# EAGLE board u4xVCA_v3 (EAGLE 9.2.1)
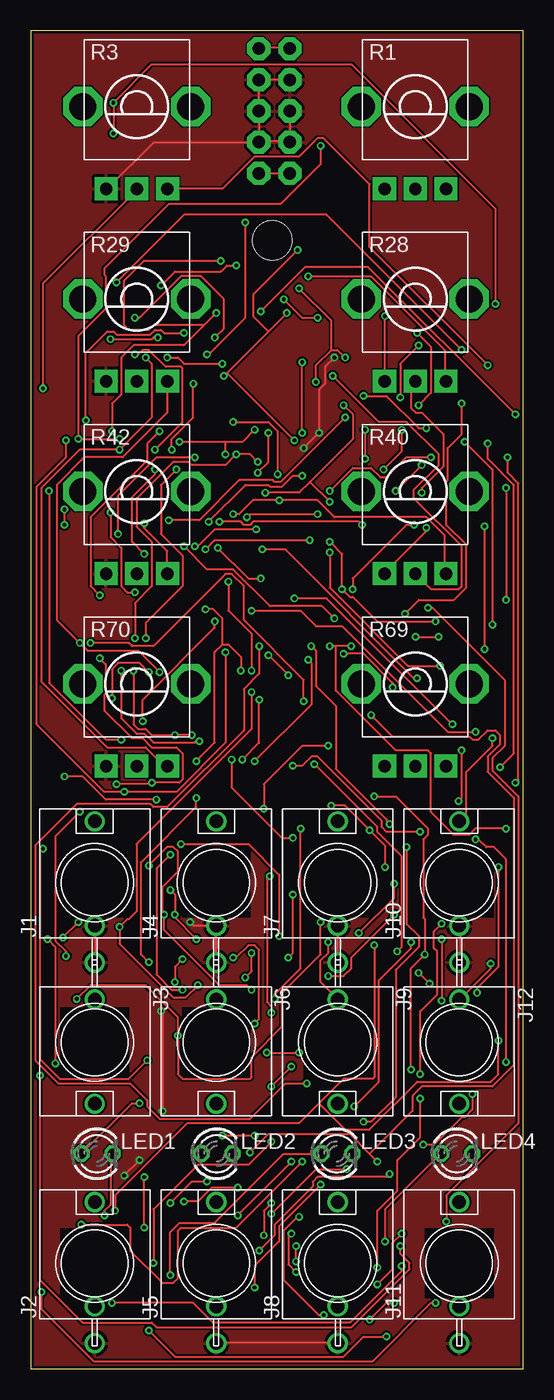
[diagram p5: board, top side]
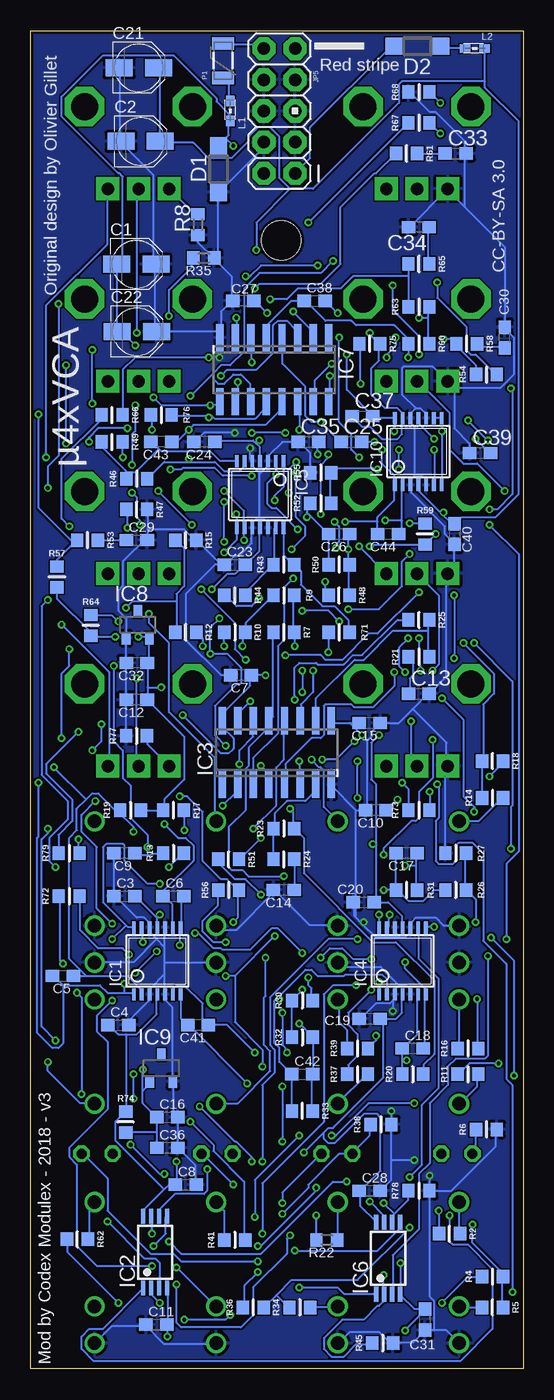
[diagram p6: board, bottom side, seen from below]

Size 40.14 x 109 mm. Coordinates in mm from the lower left corner, seen from the top.
Outline: 0,0 40.14,0 40.14,109 0,109 0,0
Copper layers (1*16): Top 0.035mm / dielectric 1.5mm / Bottom 0.035mm
Design rules "dirt_cheap_dirty_boards.v1.1": minimum track width 6mil, minimum drill 12mil, track to track 6mil, track to pad 6mil, pad to pad 6mil, via to via 6mil, smd to smd 0mil, copper to edge 10mil, drill to drill 10mil, minimum pad ring 10mil, minimum via ring 6mil, stop-mask expansion 2mil, vias tented up to drill 25mil, thermal gap 10mil
Holes 3.2 mm at 19.7,91.9

## Footprints (pad centres in the part's own frame; a part is rotated, then mirrored left to right if it is on the bottom)
PANASONIC_B = smd 2.2 x 1.4: + 1.6,0; - -1.6,0
C0603 = smd 1.1 x 1: 1 -0.85,0; 2 0.85,0
SOD123 = smd 1.4 x 1.4: A 1.9,0; C -1.9,0
TSSOP14 = smd 0.305 x 0.991: 1 -1.905,-2.718; 2 -1.27,-2.718; 3 -0.635,-2.718; 4 0,-2.718; 5 0.635,-2.718; 6 1.27,-2.718; 7 1.905,-2.718; 8 1.905,2.718; 9 1.27,2.718; 10 0.635,2.718; 11 0,2.718; 12 -0.635,2.718; 13 -1.27,2.718; 14 -1.905,2.718
TSSOP8 = smd 0.35 x 1.2: 1 -0.975,-2.925; 2 -0.325,-2.925; 3 0.325,-2.925; 4 0.975,-2.925; 5 0.975,2.925; 6 0.325,2.925; 7 -0.325,2.925; 8 -0.975,2.925
SOIC16N = smd 0.6 x 2.2: 1 -4.445,-2.6; 2 -3.175,-2.6; 3 -1.905,-2.6; 4 -0.635,-2.6; 5 0.635,-2.6; 6 1.905,-2.6; 7 3.175,-2.6; 8 4.445,-2.6; 9 4.445,2.6; 10 3.175,2.6; 11 1.905,2.6; 12 0.635,2.6; 13 -0.635,2.6; 14 -1.905,2.6; 15 -3.175,2.6; 16 -4.445,2.6
DBZ_R-PDSO-G3 = smd 0.7 x 1: 1 -0.95,-1.1; 2 0.95,-1.1; 3 0,1.1
WQP-PJ301M-12_JACK = drill 1.1: P$1 0,5; P$2 0,-3.5; P$3 0,-6.5
AVR_ICSP = drill 1.016 pad 1.88 octagon: 1 -1.27,5.08; 2 1.27,5.08; 3 -1.27,2.54; 4 1.27,2.54; 5 -1.27,0; 6 1.27,0; 7 -1.27,-2.54; 8 1.27,-2.54; 9 -1.27,-5.08; 10 1.27,-5.08
0603 = smd 0.85 x 0.7: 1 -0.9,0; 2 0.7,0
LED3MM = drill 0.813 octagon: A -1.27,0; K 1.27,0
PTC-1206 = smd 1 x 1.8: 1 -1.4,0; 2 1.4,0
ALPS_POT_VERTICAL = drill 1 pad 1.88 square: P$1 -2.5,6.7; P$2 0,6.7; P$3 2.5,6.7 | drill 2.2 pad 3.175 octagon: P$4 -4.4,0; P$5 4.4,0
PARTS_AMAN_RESISTOR_0603 = smd 1 x 1.1: 1 -0.85,0; 2 0.85,0
R0603 = smd 1 x 1.1: 1 -0.85,0; 2 0.85,0

## Placement (x,y rotation side)
C1  22u  [PANASONIC_B]  31.53,89.99 0 bottom
C2  22u  [PANASONIC_B]  31.18,99.99 0 bottom
C3  100n  [C0603]  32.5,38.5 0 bottom
C4  100n  [C0603]  33,28 0 bottom
C5  47p  [C0603]  37.5,32 180 bottom
C6  100p  [C0603]  28.5,38.5 0 bottom
C7  100n  [C0603]  23,56.5 180 bottom
C8  100n  [C0603]  27.5,15 0 bottom
C9  560p  [C0603]  32.5,42 180 bottom
C10  560p  [C0603]  12,45.5 180 bottom
C11  100n  [C0603]  29.9,3.6 0 bottom
C12  470n  [C0603]  31.5,54.5 180 bottom
C13  560p  [C0603]  8.5,55 0 bottom
C14  560p  [C0603]  19.5,39 180 bottom
C15  100n  [C0603]  12.5,52.6 180 bottom
C16  470n  [C0603]  29,20.5 0 bottom
C17  100p  [C0603]  9.5,42 180 bottom
C18  47p  [C0603]  9,26.1 0 bottom
C19  100n  [C0603]  12.5,28.5 180 bottom
C20  100n  [C0603]  13,38 0 bottom
C21  22u  [PANASONIC_B]  31.33,105.99 0 bottom
C22  22u  [PANASONIC_B]  31.48,84.49 0 bottom
C23  100n  [C0603]  23.5,65.5 0 bottom
C24  100n  [C0603]  26,75.5 180 bottom
C25  47p  [C0603]  14,75.5 0 bottom
C26  100p  [C0603]  15,68 180 bottom
C27  100n  [C0603]  22.8,87 180 bottom
C28  100n  [C0603]  12.5,14.5 0 bottom
C29  560p  [C0603]  31.5,67.5 0 bottom
C30  560p  [C0603]  1.5,84 90 bottom
C31  100n  [C0603]  8,4 90 bottom
C32  470n  [C0603]  31.5,57.5 180 bottom
C33  560p  [C0603]  5.5,99 0 bottom
C34  560p  [C0603]  8.5,93 180 bottom
C35  100n  [C0603]  17.5,75.5 0 bottom
C36  470n  [C0603]  29,18 0 bottom
C37  100p  [C0603]  13.1,77.6 0 bottom
C38  47p  [C0603]  17,87 0 bottom
C39  100n  [C0603]  3.5,74.6 0 bottom
C40  100n  [C0603]  5.6,68 270 bottom
C41  47p  [C0603]  26.5,28 180 bottom
C42  47p  [C0603]  18,24 0 bottom
C43  47p  [C0603]  29.5,75.5 180 bottom
C44  47p  [C0603]  11,68 180 bottom
D1  1N5819HW  [SOD123]  24.82,97.73 90 bottom
D2  1N5819HW  [SOD123]  8.62,107.73 180 bottom
IC1  OPA1654  [TSSOP14]  29.82,33.22 0 bottom
IC2  LM358PW  [TSSOP8]  30,9.5 0 bottom
IC3  V2164SZ  [SOIC16N]  20.09,50.19 0 bottom
IC4  OPA1654  [TSSOP14]  9.83,33.22 0 bottom
IC5  OPA1654  [TSSOP14]  21.44,71.22 180 bottom
IC6  LM358PW  [TSSOP8]  11,9 0 bottom
IC7  V2164SZ  [SOIC16N]  20.29,81.39 180 bottom
IC8  LM4040C25  [DBZ_R-PDSO-G3]  31.41,60.61 0 bottom
IC9  LM4040C10  [DBZ_R-PDSO-G3]  29.5,24.5 0 bottom
IC10  OPA1654  [TSSOP14]  8.55,74.72 0 bottom
J1  [WQP-PJ301M-12_JACK]  5.22,39.59 0 top
J2  [WQP-PJ301M-12_JACK]  5.22,8.59 0 top
J3  [WQP-PJ301M-12_JACK]  5.22,26.59 180 top
J4  [WQP-PJ301M-12_JACK]  15.12,39.59 0 top
J5  [WQP-PJ301M-12_JACK]  15.12,8.59 0 top
J6  [WQP-PJ301M-12_JACK]  15.12,26.59 180 top
J7  [WQP-PJ301M-12_JACK]  25.03,39.59 0 top
J8  [WQP-PJ301M-12_JACK]  25.03,8.59 0 top
J9  [WQP-PJ301M-12_JACK]  25.03,26.59 180 top
J10  [WQP-PJ301M-12_JACK]  34.93,39.59 0 top
J11  [WQP-PJ301M-12_JACK]  34.93,8.59 0 top
J12  [WQP-PJ301M-12_JACK]  34.93,26.59 180 top
JP5  M05X2PTH  [AVR_ICSP]  19.86,102.46 180 bottom
L1  742792664  [0603]  23.88,102.56 90 bottom
L2  742792664  [0603]  4.03,107.56 180 bottom
LED1  604-WP937EGW - R/G  [LED3MM]  5.4,17.53 0 top
LED2  R/G  [LED3MM]  15.18,17.53 0 top
LED3  R/G  [LED3MM]  24.95,17.53 0 top
LED4  R/G  [LED3MM]  34.73,17.53 0 top
P1  PTCSMD  [PTC-1206]  24.46,106.56 90 bottom
R1  10kB  [ALPS_POT_VERTICAL]  31.35,102.82 180 top
R2  510  [PARTS_AMAN_RESISTOR_0603]  6,11 180 bottom
R3  10kB  [ALPS_POT_VERTICAL]  8.65,102.82 180 top
R4  5.6k  [PARTS_AMAN_RESISTOR_0603]  2.5,7.5 0 bottom
R5  5.1k  [PARTS_AMAN_RESISTOR_0603]  2.5,5 180 bottom
R6  1.2k  [PARTS_AMAN_RESISTOR_0603]  3,19.5 0 bottom
R7  100k  [PARTS_AMAN_RESISTOR_0603]  19.5,60 180 bottom
R8  510  [R0603]  26.5,93.2 90 bottom
R9  5.1k  [PARTS_AMAN_RESISTOR_0603]  19.5,63 0 bottom
R10  5.1k  [PARTS_AMAN_RESISTOR_0603]  23.5,60 0 bottom
R11  100k  [PARTS_AMAN_RESISTOR_0603]  4.5,24 0 bottom
R12  1.0M  [PARTS_AMAN_RESISTOR_0603]  27.5,60 180 bottom
R13  510  [PARTS_AMAN_RESISTOR_0603]  28.5,42 0 bottom
R14  100k  [PARTS_AMAN_RESISTOR_0603]  2.5,46.5 0 bottom
R15  1.0M  [PARTS_AMAN_RESISTOR_0603]  27.5,67.5 180 bottom
R16  24k  [PARTS_AMAN_RESISTOR_0603]  4.5,26.1 0 bottom
R17  49.9k  [PARTS_AMAN_RESISTOR_0603]  28.5,45.5 180 bottom
R18  510  [PARTS_AMAN_RESISTOR_0603]  2.5,49.5 180 bottom
R19  20M  [PARTS_AMAN_RESISTOR_0603]  32,45.5 0 bottom
R20  20M  [PARTS_AMAN_RESISTOR_0603]  9,24 0 bottom
R21  510  [PARTS_AMAN_RESISTOR_0603]  8.5,58 0 bottom
R22  510  [R0603]  16,10.5 180 bottom
R23  49.9k  [PARTS_AMAN_RESISTOR_0603]  19.5,44 0 bottom
R24  510  [PARTS_AMAN_RESISTOR_0603]  19.5,41.5 180 bottom
R25  100k  [PARTS_AMAN_RESISTOR_0603]  8.5,61 180 bottom
R26  1.0M  [PARTS_AMAN_RESISTOR_0603]  5.5,39 0 bottom
R27  1.0M  [PARTS_AMAN_RESISTOR_0603]  5.5,42 0 bottom
R28  10kB  [ALPS_POT_VERTICAL]  31.35,87.14 180 top
R29  10kB  [ALPS_POT_VERTICAL]  8.65,87.14 180 top
R30  5.1k  [PARTS_AMAN_RESISTOR_0603]  18,30 0 bottom
R31  5.1k  [PARTS_AMAN_RESISTOR_0603]  9.5,39 0 bottom
R32  5.1k  [PARTS_AMAN_RESISTOR_0603]  18,27 0 bottom
R33  100k  [PARTS_AMAN_RESISTOR_0603]  18,21 180 bottom
R34  5.1k  [PARTS_AMAN_RESISTOR_0603]  18.2,5 0 bottom
R35  510  [R0603]  26.03,90.48 180 bottom
R36  5.6k  [PARTS_AMAN_RESISTOR_0603]  22,5 0 bottom
R37  100k  [PARTS_AMAN_RESISTOR_0603]  13.5,24 0 bottom
R38  1.2k  [PARTS_AMAN_RESISTOR_0603]  11.59,19.9 0 bottom
R39  24k  [PARTS_AMAN_RESISTOR_0603]  13.5,26.1 0 bottom
R40  10kB  [ALPS_POT_VERTICAL]  31.35,71.47 180 top
R41  510  [PARTS_AMAN_RESISTOR_0603]  23.5,10.5 0 bottom
R42  10kB  [ALPS_POT_VERTICAL]  8.65,71.47 180 top
R43  5.6k  [PARTS_AMAN_RESISTOR_0603]  19.5,65.5 180 bottom
R44  5.1k  [PARTS_AMAN_RESISTOR_0603]  23.5,63 180 bottom
R45  1.2k  [PARTS_AMAN_RESISTOR_0603]  11.45,2.1 0 bottom
R46  100k  [PARTS_AMAN_RESISTOR_0603]  31.5,72.5 0 bottom
R47  510  [PARTS_AMAN_RESISTOR_0603]  31.5,70 180 bottom
R48  5.1k  [PARTS_AMAN_RESISTOR_0603]  15,63 180 bottom
R49  5.1k  [PARTS_AMAN_RESISTOR_0603]  33.5,75.5 180 bottom
R50  5.1k  [PARTS_AMAN_RESISTOR_0603]  15,65.5 0 bottom
R51  100k  [PARTS_AMAN_RESISTOR_0603]  24,41.5 180 bottom
R52  1.0M  [PARTS_AMAN_RESISTOR_0603]  16.5,70.5 0 bottom
R53  510  [PARTS_AMAN_RESISTOR_0603]  35.5,67.5 180 bottom
R54  100k  [PARTS_AMAN_RESISTOR_0603]  3,81 0 bottom
R55  1.0M  [PARTS_AMAN_RESISTOR_0603]  16.5,73 0 bottom
R56  24k  [PARTS_AMAN_RESISTOR_0603]  24,39 0 bottom
R57  49.9k  [PARTS_AMAN_RESISTOR_0603]  38,64.5 270 bottom
R58  510  [PARTS_AMAN_RESISTOR_0603]  4.6,83.5 180 bottom
R59  20M  [PARTS_AMAN_RESISTOR_0603]  8,68 270 bottom
R60  20M  [PARTS_AMAN_RESISTOR_0603]  8.5,83.5 0 bottom
R61  510  [PARTS_AMAN_RESISTOR_0603]  9.5,99 180 bottom
R62  510  [PARTS_AMAN_RESISTOR_0603]  36.33,10.56 180 bottom
R63  49.9k  [PARTS_AMAN_RESISTOR_0603]  8.5,86.5 0 bottom
R64  24k  [PARTS_AMAN_RESISTOR_0603]  35.25,60.56 270 bottom
R65  510  [PARTS_AMAN_RESISTOR_0603]  8.5,90 180 bottom
R66  100k  [PARTS_AMAN_RESISTOR_0603]  33.5,77.7 180 bottom
R67  1.0M  [PARTS_AMAN_RESISTOR_0603]  8.5,101.5 0 bottom
R68  1.0M  [PARTS_AMAN_RESISTOR_0603]  8.5,104 0 bottom
R69  10kB  [ALPS_POT_VERTICAL]  31.35,55.79 180 top
R70  10kB  [ALPS_POT_VERTICAL]  8.65,55.79 180 top
R71  5.1k  [PARTS_AMAN_RESISTOR_0603]  15,60 0 bottom
R72  24k  [PARTS_AMAN_RESISTOR_0603]  37,38.5 0 bottom
R73  5.1k  [PARTS_AMAN_RESISTOR_0603]  8.5,45.5 0 bottom
R74  3.6k  [PARTS_AMAN_RESISTOR_0603]  32.4,20.1 270 bottom
R75  5.1k  [PARTS_AMAN_RESISTOR_0603]  12.5,83.5 180 bottom
R76  100k  [PARTS_AMAN_RESISTOR_0603]  29.5,77.7 0 bottom
R77  510  [PARTS_AMAN_RESISTOR_0603]  31.51,51.56 0 bottom
R78  1.2k  [PARTS_AMAN_RESISTOR_0603]  8.5,14.5 0 bottom
R79  100k  [PARTS_AMAN_RESISTOR_0603]  37,42 0 bottom

## Tracks (layer width: path | path; a pad name or v marks a point on that pad's centre or on a via)
1_TO_2  (via drill 0.3)
  Top 0.152: v29.62,39.5 29.62,38.38 v26.75,35.5 | v18,33.88 18,32.38 v17.5,31.88 | v6.62,5.38 13.25,5.38 14.88,3.75 26,3.75 30.25,8 v30.25,8.38 | v33.5,35 v33.5,30
  Bottom 0.152: 32.38,36.12 34.25,38 34.25,42.5 34,42.75 32.62,42.75 32.5,42.62 32.5,41.38 30.62,39.5 v29.62,39.5 | 32.38,36.12 32.25,36 31.75,36 IC1.14 | v26.75,35.5 26.5,35.5 25.25,34.25 24.62,34.25 24.5,34.12 22.25,34.12 20.5,35.88 20,35.88 v18,33.88 | v17.5,31.88 17.5,31.25 17.25,31 17.25,30 R30.2 | R4.1 4.5,7.5 v6.62,5.38 | v30.25,8.38 34.75,8.38 36.38,10 36.38,16.62 37,17.25 37,18 33.88,21.12 33.88,26.62 34.75,27.5 34.75,28.75 v33.5,30 | 32.38,36.12 v33.5,35
2_TO_3  (via drill 0.3)
  Top 0.152: v18,55.12 18,52.12 8.62,42.75 8.62,37.25 8,36.62 7.88,36.62 v7.25,36 7.25,34.62 11.62,30.25 12.62,30.25 v13.62,31.25 | v18,56.88 18,59.88 16.12,61.75 v16.12,64.12 | v21.62,7.88 21,8.5 21,10.75 v21.25,11
  Bottom 0.152: v7.25,36 7.88,36 IC4.8 | v18,56.88 v18,55.12 | v16.12,64.12 16.12,63.25 15.88,63 R48.2 | v21.62,7.88 22.75,6.75 22.75,5 R36.1 | v21.25,11 21.25,15.12 16.25,20.12 16.25,30.5 15.5,31.25 v13.62,31.25
3_TO_4
  Bottom 0.152: IC5.14 19.5,68.5 19.5,66.25 18.75,65.5 R43.1 18.62,65.5 18.12,65 18.12,63.88 16.38,62.12 15.38,62.12 14.25,61 14.25,60 R71.2
AREF_+10  (via drill 0.3)
  Top 0.152: v31,24.38 31,32.62 v32.12,33.75 32.12,36.62 32,36.75 32,43.12 32.38,43.5 32.38,44 29.75,46.62 v28,46.62 | v3.75,30.12 4.88,31.25 9.38,31.25 12,28.62 v12,27.12 12,24 12.38,23.62 17.88,23.62 18,23.75 18,25.38 20.5,27.88 20.5,30.62 23.62,33.75 v23.62,36.38
  Bottom 0.152: 31,22.62 30.5,23.12 30.5,23.38 IC9.1 | 31,22.62 31,21.62 29.88,20.5 | 29.88,20.5 29.88,19.25 | 29.88,19.25 29.88,18 C36.1 | 29.88,20.5 C16.1 | 29.88,19.25 R74.2 | v32.12,33.75 32.62,34.25 34.62,34.25 36.12,35.75 36.12,38.5 R72.2 | 31,22.62 v31,24.38 | v3.75,30.12 3.75,26.12 R16.2 | v12,27.12 12,26.75 R39.2 | 23.25,39 23.25,36.75 v23.62,36.38 | v28,46.62 27.38,46.62 26.12,45.38 26.12,41.38 24.62,39.88 24.12,39.88 23.25,39 | 23.25,39 R56.2
AREF_-2.5  (via drill 0.3)
  Top 0.152: v12.5,67 14.38,65.12 16.5,65.12 19.5,62.12 23.75,62.12 v24.75,61.12 | v25.5,58.25 27.12,58.25 29.5,55.88 v29.5,55.5 | v8.5,85.62 8.88,85.62 12.25,89 13.88,89 15.75,87.12 15.75,84.75 v15,84 | v13.38,74.25 10.25,74.25 7.12,71.12 v7.12,68 | v31.38,59.62 v33.25,59.62 | v19,45.62 19,47.62 22.12,50.75 v24.25,50.75
  Bottom 0.152: R20.2 8.12,24 8.12,24.75 7.25,25.62 7.25,31.62 10.38,34.75 12.25,34.75 17.88,40.38 17.88,43.25 18.62,44 R23.2 18.75,44 18.75,45.38 v19,45.62 | R57.2 38,62.75 35.25,60 R64.2 35.25,59.62 v33.25,59.62 | 7.75,85.62 7.75,86.5 R63.2 | 7.75,85.62 7.75,83.5 R60.2 | R19.2 R17.2 29.25,45.5 29.25,46.38 27.62,48 27.62,51.5 30.62,54.5 | 30.62,57.5 30.5,57.62 30.5,59.5 IC8.2 30.5,59.62 v31.38,59.62 | 30.62,57.5 30.62,55.5 | 30.62,55.5 30.62,54.5 | 30.62,57.5 C32.1 | 8,67.12 12.38,67.12 v12.5,67 | v24.75,61.12 25.5,60.38 v25.5,58.25 24.12,58.25 23,57.12 23,55.88 23.12,55.75 23.38,55.75 25.12,54 25.12,51.62 v24.25,50.75 | 30.62,55.5 v29.5,55.5 | 30.62,54.5 C12.1 | v8.5,85.62 7.75,85.62 | v15,84 15,77.12 14,76.12 14,74.88 v13.38,74.25 | 8,67.12 v7.12,68 | 8,67.12 R59.2
CV_IN_1
  Bottom 0.152: R11.2 3.75,24 3.75,23 5.12,21.62 J3.P$1
FOO  (via drill 0.3)
  Top 0.152: v28.88,40.88 28.88,42.62 v27.62,43.88 25.62,45.88 v24.5,45.88
  Bottom 0.152: v28.88,40.88 27.75,42 R13.2 | v27.62,43.88 27.62,45.5 R17.1 | v24.5,45.88 23.38,47 23.38,47.5 IC3.2
FOO1
  Bottom 0.152: R24.2 20.38,41.5 20.38,44 R23.1 20.25,44 20.25,45.25 19.25,46.25 17.75,46.25 17,47 17,47.5 IC3.7
FOO2  (via drill 0.3)
  Top 0.152: v18.75,86.12 22.38,89.75 27.5,89.75 v39.5,77.75
  Bottom 0.152: R57.1 38,65.88 36.62,67.25 | 36.62,67.25 36.38,67.5 R53.2 36.62,67.25 | v18.75,86.12 17.12,84.5 17.12,84 IC7.2 | v39.5,77.75 39.5,70.12 36.62,67.25
FOO3  (via drill 0.3)
  Top 0.152: v23.38,85.62 22.12,85.62 v20.62,87.12
  Bottom 0.152: 9.38,89 9.38,90 R65.2 | 9.38,89 9.38,86.5 R63.1 | v23.38,85.62 23.38,84 IC7.7 | v20.62,87.12 19.25,87.12 18.38,88 14.88,88 13.88,89 9.38,89
GND  (via drill 0.3)
  Top 0.152: v7.62,15.75 v8.88,17 | J5.P$3 15.12,2.12 25,2.12 J8.P$3 | J4.P$3 15.12,33.12 15.12,36 J4.P$2 15,36.12 13.25,36.12 v13,36.38 | J10.P$3 35,33.12 35,36 J10.P$2 | J7.P$3 25,33.12 25,36 J7.P$2 | v10.75,21 10.75,29 v10.62,29.12 | J1.P$3 5.25,33.12 5.25,36 J1.P$2 | v22.25,75 v23.5,76.25 23.5,79.75 24,80.25 24,81.62 v24.75,82.38 | JP5.8 18.62,105 | 18.62,100 18.62,102.38 JP5.5 18.62,102.5 18.62,105 | 21.12,100 21.12,102.38 JP5.6 | 21.12,100 18.62,100 | 18.62,100 JP5.3 18.5,99.88 10,99.88 6.25,96.12 R3.P$3 | 21.12,100 JP5.4 | 18.62,105 JP5.7
  Bottom 0.152: 10.75,17 10.75,15.38 11.62,14.5 C28.2 | 10.75,17 10.75,19.88 R38.2 10.75,20 v10.75,21 | 7.62,14.5 5.88,14.5 2.25,18.12 2.25,19.5 R6.2 | v8.88,17 10.75,17 | 7.62,14.5 v7.62,15.75 | 7.25,3.12 6.25,3.12 5.25,2.12 J2.P$3 | 7.25,3.12 8,3.12 | 8,3.12 9,2.12 10.5,2.12 R45.2 10.62,2.12 10.88,2.12 11.75,3 14.12,3 15,2.12 J5.P$3 | 8,3.12 C31.1 | 30.75,3.5 33.5,3.5 34.88,2.12 J11.P$3 | 30.75,3.5 29.25,2 25.12,2 J8.P$3 | 30.75,3.5 C11.1 | 7.62,14.5 7.62,5.88 7.25,5.5 7.25,3.12 | 7.62,14.5 R78.2 | J4.P$2 15.12,36.12 17.38,36.12 20.25,39 C14.2 20.38,39 20.38,38.75 23.38,35.75 24.75,35.75 25,36 J7.P$2 | 10.12,31.25 9.5,31.25 9.25,31 9.25,30.62 IC4.5 | 10.12,31.25 10.38,31 10.38,30.62 IC4.3 10.5,30.5 10.5,30.12 10.62,30 | 10.62,30 10.88,29.75 12,29.75 13.25,28.5 C19.2 | 10.12,31.25 11.62,32.75 14.75,32.75 15,33 J4.P$3 | 28.12,18 26.75,16.62 26.75,15 C8.2 | 28.12,18 28.12,20.5 C16.2 28.25,20.5 28.5,20.75 28.5,23.38 IC9.2 28.62,23.5 28.62,29.5 29.12,30 29.12,30.5 IC1.5 29.25,30.62 29.25,32.12 | 28.12,18 C36.2 | C9.2 33.38,42 33.38,38.5 C3.1 33.25,38.5 31.5,36.75 30.88,36.75 30.5,36.38 30.5,36 IC1.12 30.38,35.88 30.38,35.5 29.88,35 | 29.25,34.38 29.25,35.88 IC1.10 | 29.25,34.38 29.25,33.12 | 29.25,33.12 29.25,32.12 | 29.25,32.12 30.38,31 30.38,30.62 IC1.3 30.5,30.5 30.5,30 32.12,28.38 32.12,28 C4.2 | 29.25,34.38 29.88,35 | 29.25,33.12 25.12,33.12 J7.P$3 | 29.88,35 31.75,33.12 34.88,33.12 J10.P$3 | 10.62,30 v10.62,29.12 | 13.62,45.5 C10.2 12.75,45.5 12.75,51.12 12.38,51.5 12.38,51.88 C15.1 11.62,52.62 10.12,52.62 9,53.75 | 13.62,45.5 15.62,47.5 IC3.8 | 10,35.12 9.62,35.12 9.25,35.5 9.25,35.88 IC4.10 9.12,36 9.12,36.38 8.75,36.75 7.12,36.75 6.5,36.12 5.25,36.12 J1.P$2
  Bottom 0.152: 10,35.12 10.38,35.5 10.38,35.88 IC4.12 | 13.12,36.25 12,35.12 10,35.12 | 13.12,36.25 13.62,36.75 | 13.62,36.75 13.75,36.88 13.75,38 C20.1 | 13.62,36.75 13.62,45.5 | 8.88,72.75 8.25,72.75 8,72.5 8,72.12 IC10.5 | 8.88,72.75 9.12,72.5 9.12,72.12 IC10.3 9.12,72 9.12,71.38 6.38,68.62 6.38,68 5.62,67.25 C40.2 5.62,67.12 5.62,65.38 6.12,64.88 R42.P$3 6.25,64.75 6.25,56.38 7.62,55 C13.2 7.75,55 9,53.75 | 8.75,78.25 8.38,78.25 8,77.88 8,77.5 IC10.10 | 8.75,78.25 9.12,77.88 9.12,77.5 IC10.12 9.12,77.38 9.12,77 8.88,76.75 8.88,72.75 | R27.1 6.38,42 6.38,48.88 6.25,49 R70.P$3 6.25,49.12 6.25,51 9,53.75 | R55.1 17.38,73 17.38,74.62 18.25,75.5 C35.1 19.62,75.5 20.75,74.38 20.75,74 IC5.3 20.88,73.88 20.88,73.5 21.5,72.88 | 21.5,69.25 21.75,69.25 22,69 22,68.62 IC5.10 22.12,68.5 22.12,67.25 23.12,66.25 23.5,66.25 24.25,65.5 C23.1 | 21.5,69.25 21.12,69.25 20.88,69 20.88,68.62 IC5.12 | 21.5,69.25 21.5,72.88 | 21.5,72.88 21.5,73 22,73.5 22,73.88 IC5.5 22.12,74 22.25,74.12 v22.25,75 | v23.5,76.25 26,76.25 26.75,75.5 C24.2 | 32.38,57.5 32.38,59.5 IC8.1 32.38,59.62 32.38,61.12 33,61.75 33,63.38 32.62,63.75 32.62,65.75 30.62,67.75 | 32.38,54.5 32.38,51.62 R77.1 | 32.38,54.5 32.38,57.5 | 32.38,57.5 C32.2 | 32.38,54.5 C12.2 | 30.62,68.38 30.62,70 R47.1 | 30.62,68.38 30.62,67.75 | 30.62,67.75 30.62,67.5 C29.2 30.62,67.75 | C7.2 24.62,56.5 27.5,59.38 27.5,63.12 25.12,65.5 24.62,65.5 | C23.1 24.62,65.5 | 24.62,65.5 26.62,67.5 R15.1 26.75,67.5 27.62,68.38 30.62,68.38 | 24.38,65.5 C23.1 | 5.62,79.88 5.62,76.62 4.38,75.38 4.38,74.62 C39.1 | 5.62,79.88 6.12,80.38 R29.P$3 | 4.75,94.62 6.12,96 R3.P$3 6.25,96 9.25,93 C34.2
  Bottom 0.152: 4.75,94.62 1.5,91.38 C30.2 1.5,84.75 0.75,84 0.75,81 1.88,79.88 5.62,79.88 | 4.75,94.62 4.75,99 | 4.75,99 4.75,100 7.12,102.38 7.62,102.38 9.25,104 R68.1 | 4.75,99 C33.2 | 5.62,79.88 R29.P$3 | C21.- 32.88,105.88 32.88,100 C2.- 32.75,99.88 30.12,97.25 30.12,90.12 30,90 C1.+ 30,89.88 30,84.5 C22.+ 24.62,84.5 | 23.75,87 23.75,89 24.88,90.12 | 24.88,90.12 25.12,90.38 R35.1 | R8.1 26.5,91.75 25.25,90.5 R35.1 | 24.88,90.12 24.88,95.75 D1.C 24.75,95.88 21.25,99.38 21.25,99.88 JP5.4 | 24.88,90.12 R35.1 | 24.62,84.5 24.62,86.12 23.75,87 | 24.62,84.5 24.62,84 IC7.8 | 23.75,87 C27.2 | 24.62,84.5 IC7.8 | v24.75,82.38 24.75,83.88 IC7.8 | 8.75,78.25 9.88,79.38 9.88,81.5 9.75,81.62 7.38,81.62 6.25,80.5 R29.P$3 | 13.12,36.25 v13,36.38
  pour Top (isolate 0.012): 40,109 0,109 0,0 40,0
  pour Bottom (isolate 0.012): 40,109 0,109 0,0 40,0
N$1  (via drill 0.3)
  Top 0.152: v33.88,12 33.88,14.12 39.75,20 39.75,46.62 37.62,48.75 37.62,49.75 38.62,50.75 38.62,56.12 32.75,62 v32.38,62
  Bottom 0.152: 28.25,62.5 28.25,63.12 27.62,63.75 27.62,66.88 28.25,67.5 R15.2 | 28.25,62.5 28.25,60 R12.2 | v33.88,12 30.88,9 30,9 29.62,8.62 29.62,6.62 IC2.3 | v32.38,62 31.88,62.5 28.25,62.5
N$2
  Bottom 0.152: IC10.8 6.75,77.5 7.25,77.5 IC10.9
N$3  (via drill 0.3)
  Top 0.152: v18.62,54.5 18.62,51 v17.25,49.62
  Bottom 0.152: R25.2 10.25,61 13.12,58.12 13.88,58.12 14.62,57.38 16.75,57.38 16.88,57.5 18.25,57.5 18.62,57.12 v18.62,54.5 | v17.25,49.62 16.62,49 16.5,49 16.25,48.75 16.25,45.75 15.12,44.62 J4.P$1
N$4  (via drill 0.3)
  Top 0.152: v30.12,10 30.12,9.38 30.88,8.62 30.88,8.12 26.12,3.38 10.25,3.38 9.88,3.75 4.25,3.75 0.75,7.25 v0.75,23.88 | v3.88,36.38 v2.62,35.12
  Bottom 0.152: R27.2 4.75,42 4.75,39 R26.2 4.62,39 3.88,38.25 v3.88,36.38 | v30.12,10 29.12,11 29.12,12.38 IC2.5 | v0.75,23.88 0.75,33.25 v2.62,35.12
N$5  (via drill 0.3)
  Top 0.152: v2.88,33.62 2.88,34 2,34.88 2,43.38 v4,45.38 | v6.62,54.62 6.62,57 7.12,57.5 8.88,57.5 v9.62,56.75 | v9.38,59.5 9.38,60.75 12.38,63.75 12.38,66.25 10.62,68 10.62,72 v11.88,73.25
  Bottom 0.152: R52.2 15.75,70.5 15.75,73 R55.2 15.62,73 15.25,73.38 12.25,73.38 12.12,73.25 v11.88,73.25 | v2.88,33.62 2.88,25.5 3.12,25.25 5.5,25.25 6.12,24.62 6.12,23.12 7.62,21.62 7.62,16.75 8.5,15.88 8.5,11.38 10.62,9.25 10.62,6.12 IC6.3 | v4,45.38 4,45.75 4.88,46.62 4.88,52.88 v6.62,54.62 | v9.62,56.75 10.12,57.25 10.12,58.75 v9.38,59.5
N$6
  Bottom 0.152: R22.1 15.12,10.5 15.12,13.5 J5.P$1
N$7
  Bottom 0.152: R2.1 5.25,11 5.25,13.5 J2.P$1
N$8  (via drill 0.3)
  Top 0.152: v6.75,100.62 v6.75,103.12 9.88,106.25 26.12,106.25 37.88,94.5 v37.88,86.75 | v18.62,9.62 19.88,10.88 19.88,11.75 23,14.88 23,15.25 23.38,15.62 29,15.62 v29.25,15.88 | v32,18.25 32.88,18.25 35.12,20.5 35.38,20.5 36,21.12 v36,22.38 | v36.38,30.62 36.38,31 38.12,32.75 v38.12,40.88 | v38.75,71.75 v38.75,62.62
  Bottom 0.152: v6.75,100.62 7.62,101.5 R67.2 | v6.75,103.12 7.62,104 R68.2 | v18.62,9.62 11.88,9.62 10.12,11.38 10.12,11.88 IC6.5 | v29.25,15.88 29.62,15.88 v32,18.25 | v36,22.38 36,30.25 v36.38,30.62 | v38.12,40.88 38.62,41.38 38.62,43.25 37.12,44.75 37.12,46.25 39.25,48.38 39.25,62.12 v38.75,62.62 | v38.75,71.75 38.75,73.5 37.88,74.38 v37.88,86.75
N$9  (via drill 0.3)
  Top 0.152: v18.75,64.38 17.75,64.38 v15.25,66.88 | v15.38,69 17.12,69 17.38,68.75 17.88,68.75 18.12,69 26.75,69 v27,68.75 | v31.88,73.62 v29.75,71.5 | v31.62,78.5 32.62,79.5 32.62,83.25 v31.5,84.38
  Bottom 0.152: v18.75,64.38 19.5,63.62 19.5,59.38 20,58.88 20,51.75 22,49.75 22,47.62 IC3.3 | v15.25,66.88 15.25,67.12 15,67.38 15,68.62 v15.38,69 | v29.75,71.5 v27,68.75 | v31.88,73.62 31.88,76.12 31.62,76.38 v31.62,78.5 | v31.5,84.38 31.5,95.88 31.38,96 R1.P$2
N$10  (via drill 0.3)
  Top 0.152: v29.25,44.38 29,44.62 29,44.75 24.88,48.88 24.88,54 23.25,55.62 23.25,58.5 v22.88,58.88
  Bottom 0.152: 29.25,38.5 28.62,37.88 28.62,36 IC1.9 | R9.1 20.38,63 22.62,60.75 22.62,60 R10.2 22.75,60 22.88,59.88 v22.88,58.88 | 29.25,38.5 29.25,39 26.88,41.38 26.88,42.62 27.5,43.25 28.12,43.25 v29.25,44.38 | 29.25,38.5 C6.1
N$11
  Top 0.152: JP5.2 18.62,97.38 JP5.1
  Bottom 0.152: D2.A 10.62,107.62 10.88,107.62 17.38,101.12 17.38,98.62 18.5,97.5 JP5.1
N$12
  Top 0.152: JP5.9 18.62,107.62 21.12,107.62 JP5.10
  Bottom 0.152: P1.2 24.38,107.88 21.5,107.88 21.25,107.62 JP5.10
N$13
  Bottom 0.152: L1.2 24,103.38 24,104.75 24.38,105.12 P1.1
N$14  (via drill 0.3)
  Top 0.152: v2,24.88 2,34.38 v1.38,35 | v2.75,70 v2.75,68.75 | v1,79.88 1,88.38 8.62,96 R3.P$2
  Bottom 0.152: v2,24.88 4.38,24.88 5.25,24 R11.1 | v1.38,35 1.38,41.12 0.38,42.12 0.38,66.38 v2.75,68.75 | v2.75,70 2.12,70 0.88,71.25 0.88,79.75 v1,79.88
N$15
  Bottom 0.152: R8.2 26.5,94.12 26.88,94.12 28.75,96 R1.P$3
N$16
  Bottom 0.152: L2.2 4.75,107.62 6.62,107.62 D2.C
N$17
  Bottom 0.152: C13.1 9.25,55 9.25,56.25 9,56.5 9,57.75 9.25,58 R21.1
N$18  (via drill 0.3)
  Top 0.152: v6,12.5 6,12.88 6.5,13.38 6.5,17.38 6.62,17.5 LED1.K
  Bottom 0.152: v6,12.5 6,10.38 5.75,10.12 4.5,10.12 2.5,8.12 2.5,3.25 5.12,0.62 35,0.62 36,1.62 36,2.62 35.38,3.25 34.25,3.25 31,6.5 IC2.1
N$19  (via drill 0.3)
  Top 0.152: v29.62,5.38 29,5.38 v27.62,4 | v23.88,4.38 23.5,4.38 20.62,7.25 20.62,11.25 21.75,12.38 v21.88,12.38 | v15.62,19 v18.25,19 | v8.88,21.62 8.25,21.62 4.25,17.62 LED1.A
  Bottom 0.152: R6.1 3.88,19.5 3.88,17.88 4.12,17.62 LED1.A | v29.62,5.38 30.25,6 30.25,6.5 IC2.2 | v27.62,4 24.25,4 v23.88,4.38 | v21.88,12.38 21.88,15.38 v18.25,19 | v15.62,19 15.25,19 12.62,21.62 v8.88,21.62
N$20
  Bottom 0.152: R13.1 30.25,42 30.38,41.88 31.5,41.88 31.62,42 C9.1
N$21
  Bottom 0.152: R16.1 5.25,26.12 5.25,30 J3.P$2
N$22  (via drill 0.3)
  Top 0.152: v31,34.75 31,34.25 28.38,31.62 28.38,23.38 v26.38,21.38 | v22.12,16.88 16.75,11.5 12.25,11.5 12,11.25 12,7.38 11.62,7 10.75,7 8.12,9.62 8.12,11.5 7.88,11.75 v4.12,11.75
  Bottom 0.152: v31,34.75 31,35.88 IC1.13 | v26.38,21.38 23.5,18.5 23.38,18.5 22.12,17.25 v22.12,16.88 | v4.12,11.75 4.12,10.25 1.75,7.88 1.75,7.5 | 1.75,7.5 1.75,5 R5.1 | 1.75,7.5 R4.2
N$23
  Bottom 0.152: R41.1 24.38,10.5 24.38,12.88 25,13.5 J8.P$1
N$24
  Bottom 0.152: 7.75,60.12 7.75,61 R25.1 | 7.75,60.12 7.75,58 R21.2 | 7.75,60.12 10.62,60.12 13,57.75 13.75,57.75 16.88,54.62 16.88,52.88 IC3.10
N$25
  Bottom 0.152: R5.2 5.12,5 J2.P$2
N$26  (via drill 0.3)
  Top 0.152: v18.25,49.5 22.88,54.12 22.88,57.5 v22.62,57.75 | v26.25,63.5 26.25,64.38 30.62,68.75 v31.25,68.75 | v31.88,71.38 31.88,71.75 33.62,73.5 33.62,76.12 31.88,77.88 31.38,77.88 31,78.25 31,80.12 31.25,80.38 R28.P$2
  Bottom 0.152: v18.25,49.5 18.25,47.62 IC3.6 | v22.62,57.75 23.5,58.62 23.5,60.75 v26.25,63.5 | v31.25,68.75 31.25,69.12 31.5,69.38 31.5,71 v31.88,71.38
N$27  (via drill 0.3)
  Top 0.152: v18,30.88 17.62,31.25 15.38,31.25 10.88,35.75 v10.88,37 10.75,37.12 10.75,39.25 12,40.5 12,42.12 11.62,42.5 11.12,42.5 v9.62,41
  Bottom 0.152: 8.75,41 8.75,42 C17.1 | 8.75,41 8.75,39 R31.2 | v10.88,37 11,36.88 11,36 IC4.13 | 18.88,30 v18,30.88 | 18.88,30 18.88,27 R32.1 | 18.88,30 R30.1 | v9.62,41 8.75,41
N$28  (via drill 0.3)
  Top 0.152: v17.12,56.88 17.12,58 16.12,59 15.62,59 | 15.62,59 15,58.38 15,51 v13.5,49.5 | v13.5,46.5 13.5,45.75 9,41.25 9,33.75 v9.62,33.12 | v22.62,89 27.75,89 33.75,83 33.75,80.5 R28.P$1 | v16.75,89.88 16,89.88 15.5,89.38 11.75,89.38 v10.62,88.25 | v8.5,82.62 8.75,82.62 9.12,83 9.62,83 11,81.62 12.25,81.62 12.38,81.5 12.38,77.12 v10.12,74.88 | v10.12,73.25 10.12,72.88 8.25,71 8.25,67.38 v9.25,66.38 | v14.25,61.88 14.88,61.88 15.62,61.12 15.62,59
  Bottom 0.152: C18.2 8,26.25 8,30.5 IC4.7 8,30.62 8,31 9.62,32.62 v9.62,33.12 | v17.12,56.88 17.12,55.12 18.12,54.12 18.12,52.88 IC3.11 | v13.5,46.5 v13.5,49.5 | v22.62,89 22.25,89 21.38,89.88 v16.75,89.88 | v10.62,88.25 10.62,86.25 8.5,84.12 v8.5,82.62 | v10.12,73.25 v10.12,74.88 | v9.25,66.38 9.88,65.75 9.88,63.75 11.75,61.88 v14.25,61.88
N$29  (via drill 0.3)
  Top 0.152: v24.62,80.88 28.38,77.12 30.62,77.12 33.25,74.5 33.25,73.62 31.25,71.62 31.25,70.88 35.12,67 35.12,63.75 34.88,63.5 32.62,63.5 31.38,64.75 R40.P$2
  Bottom 0.152: v24.62,80.88 24.12,81.38 21.75,81.38 20.38,82.75 20.38,85 20,85.38 19.25,85.38 18.5,84.62 18.5,84 IC7.3
N$30  (via drill 0.3)
  Top 0.152: 15.88,75.5 17.25,75.5 v18.25,76.5 | 15.88,75.5 v12.12,75.5 | R40.P$1 33.75,64.88 33.75,67.88 32.25,69.38 24.75,69.38 23.38,70.75 v20.25,70.75 18.12,70.75 17,69.62 v16.5,69.62 | v15.88,74.5 15.88,75.5
  Bottom 0.152: v12.12,75.5 C25.2 | v18.25,76.5 18.25,78.62 18.38,78.75 IC7.14 | v20.25,70.75 20.25,71.12 19.5,71.88 19.5,73.88 IC5.1 | v15.88,74.5 15.88,74.25 16.5,73.62 v16.5,69.62
N$32  (via drill 0.3)
  Top 0.152: v28.88,85.75 28.88,80.5 R28.P$3
  Bottom 0.152: v28.88,85.75 28.88,87.88 27,89.75 27,90.38 R35.2
N$33  (via drill 0.3)
  Top 0.152: v6.62,76.38 6.62,78.62 7.38,79.38 7.38,82.38 8.38,83.38 12.5,83.38 14.12,85 | v15.12,86 14.12,85 | v15.5,90.25 9.25,90.25 7.62,88.62 7.62,85 8,84.62 9.62,84.62 10,85 14.12,85 | v37.62,60.62 37.62,73.25 v35.38,75.5 | v32.25,76.62 31.62,76.62 29,79.25 v27.12,79.25
  Bottom 0.152: v6.62,76.38 6.62,72.12 IC10.7 | v15.12,86 16.12,87 C38.2 | 25.25,81.12 25.25,80.62 24.88,80.25 24.38,80.25 23.62,81 23,81 22.25,80.25 22.25,78.88 IC7.11 | 25.25,81.12 24.62,81.75 23.88,81.75 22.75,82.88 22.75,88 21.5,89.25 16.5,89.25 v15.5,90.25 | v37.62,60.62 33.75,56.75 33.75,49.12 R69.P$1 | v35.38,75.5 35.38,75.88 34.62,76.62 v32.25,76.62 | 25.25,81.12 v27.12,79.25
N$34  (via drill 0.3)
  Top 0.152: v32.25,68.5 32.25,68.25 28.88,64.88 R40.P$3
  Bottom 0.152: v32.25,68.5 32.25,70 R47.2
N$35  (via drill 0.3)
  Top 0.152: v30.25,11 29.5,10.25 29.5,8.12 v28.25,6.88 | v19,10.88 19,12.88 v19.62,13.5
  Bottom 0.152: v30.25,11 30.25,12.38 IC2.7 | v28.25,6.88 28.25,3.75 27.88,3.38 23,3.38 22,4.38 22,6.62 19.25,9.38 19.25,10.62 v19,10.88 | v19.62,13.5 19.62,14.38 16.5,17.5 LED2.K
N$36  (via drill 0.3)
  Top 0.152: v25.75,16.25 23.25,16.25 v19.62,12.62
  Bottom 0.152: R38.1 12.5,19.88 12.5,19 13.88,17.62 LED2.A 14,17.5 15,17.5 17.5,15 17.5,14.75 v19.62,12.62 | v25.75,16.25 25.75,14.5 26,14.25 28.38,14.25 29.62,13 29.62,12.5 IC2.6
N$37  (via drill 0.3)
  Top 0.152: v9.25,11.5 v9.25,15.62
  Bottom 0.152: v9.25,15.62 8.25,16.62 8.25,21.5 6.88,22.88 6.88,31.75 8.5,33.38 8.5,35.88 IC4.9 | v9.25,11.5 13.5,7.25 18.88,7.25 20.12,6 | 20.12,6 21.12,5 R36.2 | 20.12,6 19.12,5 R34.1
N$38
  Bottom 0.152: R34.2 15.12,5 J5.P$2
N$39  (via drill 0.3)
  Top 0.152: v11.75,31.5 11.75,32.75 v12.38,33.38 | v16.5,33.5 16.75,33.5 17.75,34.5 18.25,34.5 18.62,34.12 18.62,28.5 v18.25,28.12
  Bottom 0.152: R33.1 17.25,21 17.25,24 C42.2 17.12,24 17.12,27 | v11.75,31.5 11.75,30.62 IC4.1 | v12.38,33.38 13.88,33.38 14.75,34.25 15.75,34.25 v16.5,33.5 | 17.12,27 v18.25,28.12 | 17.12,27 R32.2
N$40  (via drill 0.3)
  Top 0.152: v12.38,30.88 11.5,30.88 10.25,32.12 10.25,40.75 v11.38,41.88 | v7.38,51.25 6.12,51.25 1.5,55.88 v1.5,71.5
  Bottom 0.152: v12.38,30.88 14.25,29 14.25,28 13.5,27.25 13.5,25.5 14.25,24.75 14.25,24 R37.1 | v11.38,41.88 11.38,42.38 9.12,44.62 8.75,44.62 8.5,44.88 8.5,47 7.38,48.12 v7.38,51.25 | v1.5,71.5 3.75,73.75 4.88,73.75 6,74.88 6,77.88 8.62,80.5 R29.P$2
N$41
  Bottom 0.152: C14.1 18.62,39 18.62,41.5 R24.1
N$42  (via drill 0.3)
  Top 0.152: v10.5,56.75 8.75,58.5 4.62,58.5 v4,59.12 2.12,61 2.12,72 4.38,74.25 7.5,74.25 11.12,77.88 11.12,80.38 R29.P$1 | v9.5,25.12 8,23.62 2.38,23.62 0.75,25.25 0.75,42.12 v1,42.38
  Bottom 0.152: IC4.6 8.62,30.5 8.62,27.25 9.75,26.12 C18.1 9.88,26 9.88,25.12 | 9.88,25.12 9.88,24 R20.1 | v10.5,56.75 10.5,55.62 12.25,53.88 13.75,53.88 14,54.12 16.12,54.12 16.25,54 16.25,51.62 16.5,51.38 17.25,51.38 19.38,49.25 19.38,47.62 IC3.5 | v9.5,25.12 9.88,25.12 | v1,42.38 1,45.75 0.88,45.88 0.88,56 v4,59.12
N$43  (via drill 0.3)
  Top 0.152: v22.12,76.25 v22.12,82 | v19.38,76.25 19.38,73.88 v18.5,73 | v18.88,66.75 20.75,66.75 31.25,56.25 v31.5,56.25
  Bottom 0.152: v22.12,82 22.12,83.88 IC7.6 | v19.38,76.25 v22.12,76.25 | v18.5,73 18.5,69.38 17.75,68.62 17.75,67.88 v18.88,66.75 | v31.5,56.25 31.5,49.25 31.38,49.12 R69.P$2
N$44
  Bottom 0.152: R37.2 12.75,24 15.12,21.62 J6.P$1
N$45
  Bottom 0.152: R58.1 3.5,83.25 1.5,83.25 C30.1
N$46  (via drill 0.3)
  Top 0.152: v15.62,81.88 12.5,81.88 12,82.38 v11.12,82.38 | v10.38,84 10,84 9.88,83.88 v6.5,83.88
  Bottom 0.152: R54.1 3.88,81 3.88,81.75 5.38,83.25 5.38,83.5 R58.2 5.5,83.5 5.88,83.88 v6.5,83.88 | v15.62,81.88 17,80.5 17,78.88 IC7.15 | v11.12,82.38 11.12,82.62 10.38,83.38 v10.38,84
N$47  (via drill 0.3)
  Top 0.152: v2.75,48.25 4.25,48.25 6.12,46.38 v10.25,46.38
  Bottom 0.152: v2.75,48.25 1.75,49.25 1.75,49.5 R18.1 | v10.25,46.38 11.12,45.5 C10.1
N$49  (via drill 0.3)
  Top 0.152: v22.75,67.5 15,67.5 v14.25,66.75 | v32.62,74.25 30.62,74.25 29,72.62 28.5,72.62 27.75,73.38 26.25,73.38 v24.38,71.5
  Bottom 0.152: v22.75,67.5 22.75,68.5 IC5.9 22.75,68.62 22.75,69.88 v24.38,71.5 | 14.25,65.5 v14.25,66.75 14.25,68 C26.1 | 14.25,65.5 14.25,63 R48.1 | 14.25,65.5 R50.2 | v32.62,74.25 32.62,75.5 R49.1
N$50  (via drill 0.3)
  Top 0.152: v24.25,34.75 24.25,33.88 23.62,33.25 23.62,31.5 25,30.12 J9.P$2
  Bottom 0.152: v24.25,34.75 25.25,34.75 26.12,35.62 26.12,36.5 24.88,37.75 24.88,39 R56.1
N$51
  Bottom 0.152: R77.2 30.62,51.5 30.62,50.88 28.88,49.12 R69.P$3
N$52  (via drill 0.3)
  Top 0.152: v7,88.5 12.5,94 24.12,94 v35.12,83 | v35.12,78.62 35.12,76.12 34,75 34,72.38 33.88,72.25 33.88,68.75 35.5,67.12 35.5,63.62 34.5,62.62 31.62,62.62 v30.5,61.5
  Bottom 0.152: v7,88.5 7,87.25 4.62,84.88 4.62,83 4.25,82.62 3.88,82.62 2.25,81 R54.2 | v35.12,78.62 v35.12,83 | v30.5,61.5 30.5,60.75 28.88,59.12 28.88,53.5 25.12,49.75 25.12,44.62 J7.P$1
N$53  (via drill 0.3)
  Top 0.152: v22,44 22,32.62 19.88,30.5 v19.88,30.12
  Bottom 0.152: 20,30.25 20.25,30 20.25,26.5 19.88,26.12 19.88,25 18.88,24 | 20,30.25 17.75,32.5 17.25,32.5 16.75,32 14.62,32 14.5,32.12 11.5,32.12 11.12,31.75 11.12,30.62 IC4.2 | 18.88,24 18.88,21 R33.2 | 18.88,24 C42.1 | v22,44 20.12,45.88 20.12,49 19.5,49.62 19.5,52.75 IC3.12 | 20,30.25 v19.88,30.12
N$55  (via drill 0.3)
  Top 0.152: v21.38,38.62 21.38,33.88 v21,33.5
  Bottom 0.152: v21.38,38.62 22.62,39.88 23.5,39.88 24.75,41.12 24.75,41.5 R51.2 | v21,33.5 21,30.38 21.12,30.25 21.12,26.38 20.62,25.88 20.62,24.25 23.25,21.62 25,21.62 J9.P$1
N$56  (via drill 0.3)
  Top 0.152: v27.25,76.5 v27.25,74.12
  Bottom 0.152: 27.25,73.88 29.25,73.88 30.62,72.5 R46.2 | 27.25,73.88 25.12,73.88 24.38,73.12 23.12,73.12 22.75,73.5 22.75,73.88 IC5.6 | C43.1 28.25,75.5 v27.25,76.5 26.88,76.88 21,76.88 19.75,78.12 19.75,78.75 IC7.13 | v27.25,74.12 27.25,73.88
N$58  (via drill 0.3)
  Top 0.152: v18.25,6.62 18.25,8.38 20.25,10.38 20.25,11.62 v23.62,15
  Bottom 0.152: v18.25,6.62 15.12,6.62 14.62,6.12 12,6.12 IC6.1 | v23.62,15 26.12,17.5 LED3.K
N$59  (via drill 0.3)
  Top 0.152: v11.38,7.62 11.38,11.12 12.12,11.88 15,11.88 20.62,17.5 23.62,17.5 LED3.A
  Bottom 0.152: R45.1 12.38,2 13.62,2 14.62,1 15.62,1 16.25,1.62 16.25,2.5 14.75,4 13,4 11.88,5.12 11.75,5.12 11.38,5.5 11.38,6 IC6.2 11.38,6.12 v11.38,7.62
N$60
  Bottom 0.152: IC5.13 20.25,68.5 20.25,65.5 R43.2 20.38,65.5 22.62,63.25 22.62,63 R44.1
N$61  (via drill 0.3)
  Top 0.152: v21.5,62.75 24.12,62.75 v34.38,52.5 | v35.12,50.38 35.12,46.5 v34.88,46.25 | v33.5,36.25 32.88,35.62 32.88,34.25 33.12,34 33.12,30.5 31.75,29.12 v31.75,24 | v31.75,22 31.75,18.88 29.88,17 29.88,14.5 28.25,12.88 v28.25,8.25
  Bottom 0.152: v21.5,62.75 22.12,62.12 23.38,62.12 24.25,63 R44.2 | v34.38,52.5 34.38,51.12 v35.12,50.38 | v34.88,46.25 36,45.12 36,43.75 34.75,42.5 34.75,37.5 v33.5,36.25 | v31.75,22 v31.75,24 | v28.25,8.25 25.12,5.12 J8.P$2
N$62  (via drill 0.3)
  Top 0.152: v11.25,69.12 13.75,69.12 17,72.38 19.75,72.38 19.88,72.25 20.38,72.25 v25.62,77.5
  Bottom 0.152: 9.88,69.12 9.88,68.25 10.12,68 C44.1 | 9.88,69.12 9.88,72 IC10.2 | 25.62,77.62 25.38,77.62 25.12,77.38 21.88,77.38 21,78.25 21,78.75 IC7.12 | 25.62,77.62 28.62,77.62 R76.2 | v11.25,69.12 9.88,69.12 | 25.62,77.62 v25.62,77.5
N$63
  Bottom 0.152: R53.1 C29.1
N$64
  Bottom 0.152: R39.1 14.38,26.12 14.38,27.62 15,28.25 15,30 J6.P$2
N$65  (via drill 0.3)
  Top 0.152: v21.38,49.12 22.12,49.12 22.88,49.88 23.38,49.88 28.62,44.62 28.62,44.12 29,43.75 v31.75,43.75 | v37.25,81.75 27.62,91.38 27.62,96.5 23.88,100.25 23.38,100.25 21.88,98.75 18.25,98.75 15.62,96.12 11.25,96.12 R3.P$1 | v37.25,75.38 37.25,74.12 39.38,72 39.38,50.12 v38.25,49
  Bottom 0.152: C5.1 35.62,32 | 35.62,32 32.25,32 31.12,30.88 31.12,30.62 IC1.2 | 33.12,45.5 33.25,45.5 34.62,46.88 35.12,46.88 35.62,46.38 | 35.62,46.38 36.38,45.62 36.38,43.88 37,43.25 37,33.38 35.62,32 | v21.38,49.12 20.75,48.5 20.75,47.62 IC3.4 | v31.75,43.75 31.75,44.12 33.12,45.5 | 33.12,45.5 R19.1 | v37.25,75.38 v37.25,81.75 | 35.62,46.38 v38.25,49
N$66
  Bottom 0.152: R14.2 1.75,46.5 3.62,44.62 5.12,44.62 J1.P$1
N$67  (via drill 0.3)
  Top 0.152: v9.25,68.88 9.25,68.5 11.12,66.62 11.12,64.88 R42.P$1 | v20.12,72.88 20.12,76.38 19.38,77.12 v16.5,77.12 | v13.38,67 13.62,67 15,68.38 v18.38,68.38
  Bottom 0.152: v9.25,68.88 8,68.88 R59.1 | IC5.2 20.12,73.88 v20.12,72.88 20.88,72.12 20.88,70.5 20.5,70.12 20.12,70.12 v18.38,68.38 | C25.1 14.88,75.5 v16.5,77.12 17.25,77.12 17.75,77.62 17.75,80 19.62,81.88 19.62,83.88 IC7.4 | v13.38,67 11.25,64.88 R42.P$1
N$69  (via drill 0.3)
  Top 0.152: v37,58.62 v37,68.62 | v37.62,51.38 37.62,50.75 35.5,48.62 35.5,45.12 35,44.62 J10.P$1
  Bottom 0.152: v37,68.62 37.62,69.25 37.62,74.12 34.38,77.38 34.38,77.62 R66.2 | v37,58.62 37,57.25 37.62,56.62 v37.62,51.38
N$70  (via drill 0.3)
  Top 0.152: v21.38,43.25 20.5,43.25 16.38,47.38 v16.38,49.62 | v13.75,51.12 13.5,51.12 13.38,51 10,51 9.25,51.75 8.62,51.75 7.38,53 v7.38,56.88
  Bottom 0.152: v21.38,43.25 23.12,41.5 R51.1 | v16.38,49.62 15.25,49.62 v13.75,51.12 | v7.38,56.88 6.88,57.38 6.88,63 8.62,64.75 R42.P$2
N$71
  Bottom 0.152: R62.1 35.38,10.62 35.38,13.12 35,13.5 J11.P$1
N$72
  Bottom 0.152: R61.1 C33.1
N$73  (via drill 0.3)
  Top 0.152: v25.62,82.38 25,83 24.5,83 | 24.5,83 23.25,81.75 v23.25,80.38 | v21.88,88 24.5,85.38 24.5,83
  Bottom 0.152: v25.62,82.38 31.62,82.38 32.62,81.38 32.62,77.75 R66.1 | v23.25,80.38 23.25,79 23.38,78.88 IC7.10 | v21.88,88 21.5,88.38 16.5,88.38 14.88,90 14.88,94.62 12.12,97.38 12,97.38 10.38,99 R61.2
N$75  (via drill 0.3)
  Top 0.152: v4.88,59.12 8,59.12 8.25,58.88 10,58.88 15.88,64.75 16.38,64.75 17.38,63.75 17.38,61 22.25,56.12 v22.25,54.38
  Bottom 0.152: R14.1 3.38,46.5 3.38,49.5 R18.2 3.25,49.5 3.25,54.12 2.38,55 2.38,56.62 v4.88,59.12 | v22.25,54.38 23.25,53.38 23.25,52.88 IC3.15
N$76  (via drill 0.3)
  Top 0.152: v15.88,58.38 15.88,51 11.88,47 v7.62,47 6,47 0.5,52.5 0.5,71.88 2.88,74.25 v2.88,75.62 | v12.5,84.38 10.88,84.38 10.62,84.62 10.12,84.62 9.75,84.25 7,84.25 6.75,84.5 6.25,84.5 4.5,82.75 v4.5,77.25
  Bottom 0.152: C37.1 13.88,77.5 13.12,76.75 12.5,76.75 11.5,75.75 10.25,75.75 9.88,76.12 9.88,77.38 IC10.13 9.88,77.5 9.88,77.88 10.25,78.25 11.25,78.25 12.38,79.38 12.38,81.5 11.75,82.12 11.75,83.5 | v7.62,47 7.62,45.5 R73.2 | v15.88,58.38 15.88,60 R71.1 | 11.75,83.5 12.5,84.25 v12.5,84.38 | v2.88,75.62 v4.5,77.25 | 11.75,83.5 R75.1
N$77  (via drill 0.3)
  Top 0.152: v36.25,43.12 36.5,43.12 37.12,42.5 37.75,42.5 38.75,41.5 v38.75,25
  Bottom 0.152: v36.25,43.12 36.25,42 R79.2 | v38.75,25 38.75,24.25 36.12,21.62 35,21.62 J12.P$1
N$84  (via drill 0.3)
  Top 0.152: v12.5,13.62 13.62,13.62 14.75,14.75 v16.88,14.75 | v21.62,8.75 v21.62,10
  Bottom 0.152: v12.5,13.62 11.38,12.5 11.38,12 IC6.7 | v16.88,14.75 16.88,14.5 21.38,10 v21.62,10 | v21.62,8.75 27.88,8.75 28.5,9.38 30.38,9.38 33.88,12.88 33.88,15.5 35.88,17.5 LED4.K
N$85  (via drill 0.3)
  Top 0.152: v11.38,13.5 13.12,15.25 v14.38,15.25 | v28.88,10.38 28.88,13 33.38,17.5 LED4.A
  Bottom 0.152: 10.5,12.62 10.62,12.5 10.62,12 IC6.6 | 10.5,12.62 9.38,13.75 9.38,14.5 R78.1 | v11.38,13.5 10.5,12.62 | v14.38,15.25 15.5,15.25 21.38,9.38 27.88,9.38 v28.88,10.38
N$87  (via drill 0.3)
  Top 0.152: v23.12,49.25 28.25,44.12 28.25,43.75 30.25,41.75 30.25,34.38 v29.88,34 | v32.5,31.38 v31.62,32.25 | v38.88,74.25 38.88,73 39.75,72.12 39.75,48 v39.5,47.75
  Bottom 0.152: 32.5,30.62 33.88,30.62 34.5,31.25 37.5,31.25 | 32.5,30.62 31.75,30.62 IC1.1 | 37.5,31.25 38.25,32 C5.2 | v23.12,49.25 23.12,50.38 22,51.5 22,52.75 IC3.14 | v31.62,32.25 v29.88,34 | 32.5,30.62 v32.5,31.38 | v38.88,74.25 38.88,86.62 33.88,91.62 33.88,96 R1.P$1 | v39.5,47.75 39.5,43.38 39.62,43.25 39.62,27.38 38.38,26.12 37.88,26.12 37.5,26.5 37.5,31.25
N$88  (via drill 0.3)
  Top 0.152: v13.25,80.25 13.25,77.5 11.5,75.75 v11.5,74.88 | v30.25,76.5 30.25,74.75 v28.75,73.25 | v22.12,72.75 21.38,72.75 20.5,71.88 19.5,71.88 19.38,72 17.5,72 v14.5,69
  Bottom 0.152: 11.88,69 11.88,68 C44.2 | 11.88,69 11.88,69.38 10.5,70.75 10.5,72 IC10.1 10.5,72.12 10.5,72.75 11.5,73.75 v11.5,74.88 | v13.25,80.25 13.25,83.5 R75.2 | v30.25,76.5 30.25,77.62 R76.1 | v28.75,73.25 27.88,73.25 27.75,73.38 25.12,73.38 24.5,72.75 v22.12,72.75 | 11.88,69 v14.5,69
N$89  (via drill 0.3)
  Top 0.152: v36.25,51.88 34,51.88 25.38,60.5 23.25,60.5 22,61.75 v18,61.75 | v15,60.88 15,60.38 9.12,54.5 v9.12,52.75
  Bottom 0.152: v36.25,51.88 38.88,49.25 38.88,48.5 36.75,46.38 36.75,44.62 37.88,43.5 37.88,42 R79.1 | v18,61.75 15.88,61.75 v15,60.88 | v9.12,52.75 9.12,49.5 8.75,49.12 R70.P$2
N$90
  Bottom 0.152: R65.1 7.75,90 7.75,93 C34.1
N$91  (via drill 0.3)
  Top 0.152: v9.38,82.38 9.88,81.88 9.88,77.5 v7.25,74.88 4,74.88 0.88,71.75 0.88,56 6.25,50.62 9.38,50.62 10.88,49.12 11.12,49.12 R70.P$1
  Bottom 0.152: IC7.5 20.88,84 20.88,85 18.88,87 C38.1 17.75,87 16.12,85.38 14,85.38 13.62,85 10.5,85 9.38,83.88 9.38,83.5 | v7.25,74.88 7.25,72.12 IC10.6 | 9.38,83.5 v9.38,82.38 | 9.38,83.5 R60.1
N$96  (via drill 0.3)
  Top 0.152: v19.25,25.75 v21.88,25.75 | v19.62,29 19.62,29.5 19.25,29.88 19.25,39.88 v19.5,40.12
  Bottom 0.152: IC1.6 28.5,30.62 28.5,31 28.25,31.25 27.62,31.25 26.12,29.75 26.12,28.38 25.75,28 C41.1 24.12,28 v21.88,25.75 | R7.2 20.38,60 20.38,53.12 20.62,52.88 IC3.13 20.75,52.75 20.75,52.25 22.38,50.62 22.38,49.12 22.62,48.88 22.62,45.5 24,44.12 24,40.88 23.75,40.62 22.88,40.62 22.38,40.12 v19.5,40.12 | v19.25,25.75 19.25,26 19.62,26.38 v19.62,29
N$100  (via drill 0.3)
  Top 0.152: v22.5,23.25 20.75,23.25 17.88,20.38 10.5,20.38 9.5,21.38 9.5,21.88 8.12,23.25 2.25,23.25 0.38,25.12 0.38,42.62 3.75,46 9.75,46 10,45.75 11.12,45.75 17.38,52 17.38,55.38 18.62,56.62 v18.62,58.88
  Bottom 0.152: IC1.7 27.88,30.5 27.88,28.5 27.38,28 C41.2 27.25,28 v22.5,23.25 | R9.2 18.75,63 18.75,60 R7.1 18.62,60 v18.62,58.88
N$103
  Bottom 0.152: 32.38,73 32.38,73.12 34.25,75 34.25,75.5 R49.2 | 32.38,73 32.38,72.5 R46.1 32.38,73 | 29.62,74.88 30.25,75.5 C43.2 | 29.62,74.88 29.5,74.75 25.5,74.75 24.75,74 23.38,74 IC5.7 | 32.38,73 31.62,73 29.75,74.88 29.62,74.88
N$105  (via drill 0.3)
  Top 0.152: v37.5,33 37.5,32.62 35,30.12 J12.P$2
  Bottom 0.152: v37.5,33 37.75,33.25 37.75,38.5 R72.1
OUT1  (via drill 0.3)
  Top 0.152: v26.12,58.88 24.88,58.88 | 24.88,58.88 v24.38,58.88 | v6.88,12.88 6.88,14.12 12.75,20 21.88,20 23.5,21.62 | 23.5,21.62 25.5,23.62 27.88,23.62 28,23.75 v28,34.5 | 24.88,58.88 24.88,55.25 29.75,50.38 32.38,50.38 32.62,50.12 32.62,45.38 34.5,43.5 35.75,43.5 36.25,44 v38.75,44 | v38.12,26.75 38.12,24 37.5,23.38 31.5,23.38 27.62,19.5 25.62,19.5 23.5,21.62
  Bottom 0.152: v24.38,58.88 24.38,60 R10.1 | v26.12,58.88 26.12,59.5 26.62,60 R12.1 | C6.2 27.75,38.5 27.88,38.38 27.88,36 IC1.8 28,35.88 v28,34.5 | v6.88,12.88 6.88,11 R2.2 | v38.75,44 38.75,43.62 39.25,43.12 39.25,27.88 v38.12,26.75
OUT2  (via drill 0.3)
  Top 0.152: v11.38,39 11.75,38.62 v11.75,37 11.75,36.75 v13.5,35 | v21.25,16.88 v16.88,12.5
  Bottom 0.152: v11.75,37 11.75,36 IC4.14 | 10.38,39 v11.38,39 | v16.88,12.5 16.88,10.5 R22.2 | v21.25,16.88 21.25,23.12 20.25,24.12 20.25,26 20.62,26.38 20.62,30.25 15.88,35 v13.5,35 | R26.1 7.25,39 8.12,38.12 9.38,38.12 10.25,39 R31.1 10.38,39 | 10.38,39 10.38,42 C17.2
OUT3  (via drill 0.3)
  Top 0.152: v23.38,69.62 17.88,69.62 v17.62,69.38 | v27.12,20.12 27.75,20.12 29.75,22.12 29.75,32.5 31.62,34.38 31.62,35.25 30.62,36.25 v30.62,42.5 | v33.38,57.25 30.75,57.25 24.38,63.62 v24.38,66.5
  Bottom 0.152: 15.88,68 15.88,65.5 R50.1 | v23.38,69.62 23.38,68.62 IC5.8 23.38,68.5 23.38,67.5 v24.38,66.5 | 17.62,69.75 17.62,70.25 17.38,70.5 R52.1 | 17.62,69.75 v17.62,69.38 | v27.12,20.12 25.25,18.25 25.25,17.75 22.75,15.25 22.75,10.5 R41.2 | v30.62,42.5 30.62,43.5 32,44.88 32,47.5 32.62,48.12 32.62,50.38 33.38,51.12 v33.38,57.25 | 17.62,69.75 15.88,68 | 15.88,68 C26.2
OUT4  (via drill 0.3)
  Top 0.152: v5.62,57.88 6.12,57.38 6.12,55 6,54.88 6,53.62 8.25,51.38 9.12,51.38 9.88,50.62 11.88,50.62 12.38,50.12 12.38,48 12.12,47.75 v9.88,47.75 9.75,47.62 v7,47.62 | v5.62,63 4.88,63.75 4.88,69.38 9.5,74 9.5,75.38 v10.5,76.38 | v33,5.38 32.62,5.38 27.88,0.62 5.12,0.62 0.88,4.88 v0.88,6.25 | v17.5,93.38 17.5,85.62 14.5,82.62 v14.38,82.62
  Bottom 0.152: v9.88,47.75 9.38,47.25 9.38,45.5 R73.1 | v5.62,63 v5.62,57.88 | v10.5,76.38 10.5,77.38 IC10.14 10.5,77.5 12.25,77.5 C37.2 12.25,77.62 14.38,79.75 v14.38,82.62 | v33,5.38 37.12,9.5 37.12,10.5 R62.2 | v0.88,6.25 0.88,23.12 1.38,23.62 1.38,33 3.25,34.88 3.25,42 4.12,42.88 5.25,42.88 5.5,42.62 5.5,41.38 5.75,41.12 6.88,41.12 7.12,41.38 7.12,44.62 6.88,44.88 6.88,47.5 v7,47.62 | v17.5,93.38 9.38,101.5 R67.1
VCC  (via drill 0.3)
  Top 0.152: 27.62,17.5 26,19.12 19.38,19.12 v17.88,17.62 | 27.62,17.5 v28.25,16.88 | v15.75,80.88 16,81.12 | 16,81.12 19.38,84.5 | 19.38,84.5 v20.88,86 | 16,81.12 v21.5,75.62 | v19.38,58.12 v21,56.5 | v8.5,63.25 7.88,63.25 7.38,63.75 7.38,66.88 6.5,67.75 v6.5,69.75 | 19.38,84.5 18.12,85.75 18.12,87.5 v21.75,91.12 | 27.62,17.5 31.12,21 31.12,22.25 31.88,23 37.62,23 39.38,24.75 39.38,46.5 37.25,48.62 37.25,49.88 38.25,50.88 38.25,51.62 37.88,52 37.25,52 36.5,51.25 36,51.25 35.75,51.5 29.5,51.5 v27.75,53.25
  Bottom 0.152: 29.25,14.62 30.88,13 30.88,12.5 IC2.8 | 29.25,14.62 28.88,15 C8.1 28.25,15 v28.25,16.88 | 32.38,27.25 33,27.25 33.75,28 C4.1 | 32.38,27.25 31.5,27.25 29.88,28.88 29.88,30.5 IC1.4 | 32.38,27.25 32.38,21 R74.1 32.5,20.88 33.25,20.12 33.25,18.62 29.25,14.62 | 11.38,28.5 C19.1 11.62,28.5 | 11.38,28.5 10.38,28.5 9.88,29 9.88,30.5 IC4.4 | 13.25,14.5 13.25,13.25 12,12 IC6.8 | 11.38,28.5 11.38,23.75 15.5,19.62 15.88,19.62 16.25,19.25 | 16.25,19.25 16.25,18.75 15.88,18.38 15.38,18.38 13,20.75 11.88,20.75 11.62,20.5 11.62,16.12 13.25,14.5 | 13.25,14.5 C28.1 | 16.25,19.25 v17.88,17.62 | 21.75,75.38 22,75.62 25,75.62 25.12,75.5 C24.1 | 21.75,75.38 21.5,75.12 21.5,74 IC5.4 | v20.88,86 21.88,87 C27.1 | v15.75,80.88 15.75,78.88 IC7.16 | v21.5,75.62 21.75,75.38 | C21.+ 29.62,105.88 29.62,100 C2.+ 29.5,99.88 26.88,99.88 25.62,98.62 23.75,98.62 22.38,100 22.38,100.38 21.62,101.12 20.62,101.12 19.88,100.38 19.88,97 19,96.12 | 3.12,104.88 3.12,104.38 0.38,101.62 0.38,71.25 2.25,69.38 5,69.38 5.5,68.88 C40.1 5.62,68.88 5.88,68.88 6.62,69.62 | 3.12,104.88 3.12,107.5 L2.1 | 6.62,69.62 8.5,71.5 8.5,72 IC10.4 | v21,56.5 C7.1 22.25,56.5 22.25,55.62 24.5,53.38 24.5,52.88 IC3.16 24.5,52.75 24.5,52.25 23.62,51.38 23.62,50.5 24,50.12 24.62,50.12 v27.75,53.25 | v19.38,58.12 16.5,58.12 16.12,57.75 14.75,57.75 12.62,59.88 11.88,59.88 v8.5,63.25 | 6.62,69.62 v6.5,69.75 | 19,96.12 17.12,96.12 10.12,103.12 10.12,104.62 9.88,104.88 3.12,104.88 | v21.75,91.12 21.75,93.38 19,96.12
VEE  (via drill 0.3)
  Top 0.152: v29,2.62 27.12,2.62 25.5,1 11.75,1 v9.62,3.12 | v13.12,51.62 v11.75,51.62 9.88,51.62 9.38,52.12 8.75,52.12 8.38,52.5 v8.38,56.88 | v29.62,37 26.12,33.5 26.12,32.62 25.5,32 v24.25,32 | v20.25,35.25 20.25,40.25 17.75,42.75 v12.25,42.75 | v10,8.62 10,13 13.62,16.62 17.75,16.62 v19.62,18.5 | v21.25,24.62 v19.62,23 | v18.5,73.88 17.88,74.5 v16.75,74.5 15.88,73.62 13.12,73.62 12.88,73.88 11.62,73.88 8.62,70.88 8.62,68.62 9.88,67.38 9.88,63.75 8.5,62.38 v8.5,59.5 | v19.12,71.38 21.88,71.38 22.75,72.25 | 22.75,72.25 26.25,75.75 26.25,77.75 v25.5,78.5 | v33,60.88 28.25,60.88 26.25,62.88 26,62.88 v25.38,63.5 25.38,66.38 v24.38,67.38 | v24.38,70.62 22.75,72.25 | v7.25,75.75 v3.88,75.75 3.88,84.12 6.12,86.38 6.12,89 6,89.12 6,89.62 11.25,94.88 20.38,94.88 23.62,98.12 v23.62,99.62 | v30.12,79.12 30.12,81.88 v31.62,83.38
  Bottom 0.152: IC2.4 29,6.5 29,3.62 C11.2 29,3.5 v29,2.62 | v9.62,3.12 8,4.75 C31.2 8,4.88 8.88,4.88 10,6 IC6.4 10,6.12 v10,8.62 | 29.88,36.75 29.88,36 IC1.11 | 29.88,36.75 31.62,38.5 C3.2 | 12,38 C20.2 12.12,38 | 12,38 11,38 9.88,36.88 9.88,36 IC4.11 | 14.12,52.62 15.5,52.62 15.62,52.75 IC3.9 | 14.12,52.62 13.38,52.62 C15.2 | 12,42.75 12,47.62 12.38,48 12.38,51 v11.75,51.62 | 12,42.75 12,38 | 14.12,52.62 v13.12,51.62 | v29.62,37 29.88,36.75 | 23.5,32 v24.25,32 | v20.25,35.25 23.5,32 | 12,42.75 v12.25,42.75 | v19.62,23 v19.62,18.5 | v21.25,24.62 21.25,26 23.5,28.25 23.5,32 | v16.75,74.5 16.75,75.5 C35.2 | v18.5,73.88 19.12,73.25 v19.12,71.38 | IC7.9 24.75,78.75 25,78.5 v25.5,78.5 29.5,78.5 v30.12,79.12 | IC5.11 21.5,68.5 21.5,66.62 22.62,65.5 C23.2 22.75,65.5 23.5,64.75 24.12,64.75 v25.38,63.5 | v33,60.88 33.5,61.38 35.25,61.38 R64.1 | v24.38,67.38 v24.38,70.62 | v7.25,75.75 8.5,77 8.5,77.38 IC10.11 | v3.88,75.75 2.75,74.62 C39.2 | 24.25,100.25 24.75,99.75 D1.A 24.25,100.25 | 24.25,100.25 24,100.5 24,101.62 L1.1 24,101.75 24,102.25 25,103.25 25,103.5 28.5,107 34.25,107 37.62,103.62 37.62,102 33,97.38 32.88,97.38 32.62,97.12 32.62,90.5 C1.- 33.12,89.88 33.12,84.88 | 33.12,84.88 33.12,84.5 C22.- 33.12,84.88 | 24.25,100.25 v23.62,99.62 | 33.12,84.88 v31.62,83.38 | v8.38,56.88 8.38,57.25 8.5,57.38 v8.5,59.5

## Text on the board
bNames: Original design by Olivier Gillet | Red stripe | CC-BY-SA 3.0 | µ4xVCA | Mod by Codex Modulex - 2018 - v3